# EAGLE design Controller (EAGLE 9.5.2)
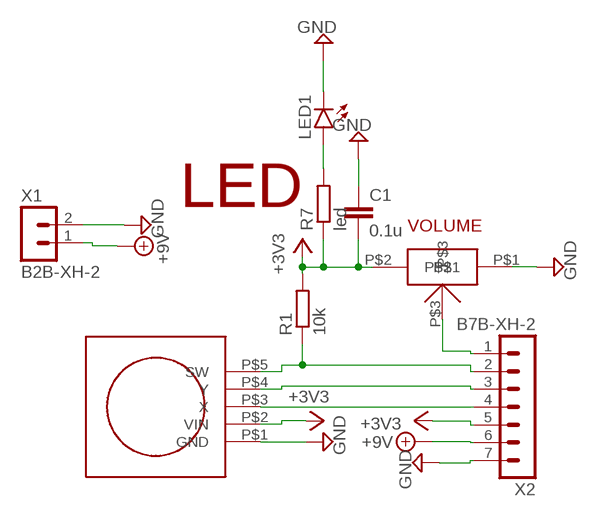
[diagram p0: schematic, sheet 1]

## Parts
C1  0.1u  C-EU050-024X044  [C050-024X044]
JOY1  JOY  [JOY]
LED1  LED3MM  [LED3MM]
POT1  POTENTIOMETER  [POTENTIOMETER]
R1  10k  R-EU_0207/7  [0207/7]
R7  led  R-EU_0207/7  [0207/7]
X1  B2B-XH-2  [B2B-XH-A]
X2  B7B-XH-2  [B7B-XH-A]

## Nets
+3V3: C1.2 JOY1.P$2(VIN) POT1.P$2 R1.2 R7.1 X2.5
+9V: X1.1 X2.6
GND: C1.1 JOY1.P$1(GND) LED1.K(C) POT1.P$1 X1.2 X2.7
N$2: JOY1.P$4(Y) X2.3
N$3: JOY1.P$5(SW) R1.1 X2.2
N$4: POT1.P$3 X2.1
N$5: JOY1.P$3(X) X2.4
N$15: LED1.A R7.2

## Notes on the sheet
- LED
- VOLUME

## Library data of the parts
C1 = rcl:C-EU: CAPACITOR, European symbol; SPICEPREFIX: C
JOY1 = JOYSTICK:JOY
LED1 = led:LED: LED OSRAM: - CHIPLED LG R971, LG N971, LY N971, LG Q971, LY Q971, LO R971, LY R971 LH N974, LH R974 LS Q976, LO Q976, LY Q976 LO Q996 - Hyper CHIPLED LW Q18S LB Q993, LB Q99A, LB R99A - SideLED LS A670, LO A670, LY A670, LG A670, LP A670 LB A673, LV A673, LT A673, LW A673 LH A674 LY A675 LS A676, LA A676, LO A676, LY A676, LW A676 LS A679, LY A679, LG A679 - Hyper Micro SIDELED® LS Y876, LA Y876, LO Y876, LY Y876 LT Y87S - SmartLED LW L88C, LW L88S LB L89C, LB L89S, LG L890 LS L89K, LO L89K, LY L89K LS L896, LA L896, LO L896, LY L896 - TOPLED LS T670, LO T670, LY T670, LG T670, LP T670 LSG T670, LSP T670, LSY T670, LOP T670, LYG T670 LG T671, LOG T671, LSG T671 LB T673, LV T673, LT T673, LW T673 LH T674 LS T676, LA T676, LO T676, LY T676, LB T676, LH T676, LSB T676, LW T676 LB T67C, LV T67C, LT T67C, LS T67K, LO T67K, LY T67K, LW E67C LS E67B, LA E67B, LO E67B, LY E67B, LB E67C, LV E67C, LT E67C LW T67C LS T679, LY T679, LG T679 LS T770, LO T770, LY T770, LG T770, LP T770 LB T773, LV T773, LT T773, LW T773 LH T774 LS E675, LA E675, LY E675, LS T675 LS T776, LA T776, LO T776, LY T776, LB T776 LHGB T686 LT T68C, LB T68C - Hyper Mini TOPLED® LB M676 - Mini TOPLED Santana® LG M470 LS M47K, LO M47K, LY M47K Source: http://www.osram.convergy.de LUXEON: - LUMILED® LXK2-PW12-R00, LXK2-PW12-S00, LXK2-PW14-U00, LXK2-PW14-V00 LXK2-PM12-R00, LXK2-PM12-S00, LXK2-PM14-U00 LXK2-PE12-Q00, LXK2-PE12-R00, LXK2-PE12-S00, LXK2-PE14-T00, LXK2-PE14-U00 LXK2-PB12-K00, LXK2-PB12-L00, LXK2-PB12-M00, LXK2-PB14-N00, LXK2-PB14-P00, LXK2-PB14-Q00 LXK2-PR12-L00, LXK2-PR12-M00, LXK2-PR14-Q00, LXK2-PR14-R00 LXK2-PD12-Q00, LXK2-PD12-R00, LXK2-PD12-S00 LXK2-PH12-R00, LXK2-PH12-S00 LXK2-PL12-P00, LXK2-PL12-Q00, LXK2-PL12-R00 Source: www.luxeon.com KINGBRIGHT: KA-3528ASYC Source: www.kingbright.com
POT1 = potentiometer:POTENTIOMETER
R1 R7 = rcl:R-EU_: RESISTOR, European symbol; SPICEPREFIX: R
X1 = con-JST XH:B2B-XH: JST XH series header 2.50mm pitch disconnectable crimp style connectors, vertical (side entry type), 2 pins
X2 = con-JST XH:B7B-XH: JST XH series header 2.50mm pitch disconnectable crimp style connectors, vertical (side entry type), 7 pins

## Net classes
0 default: clearance 0.508 mm

## Board
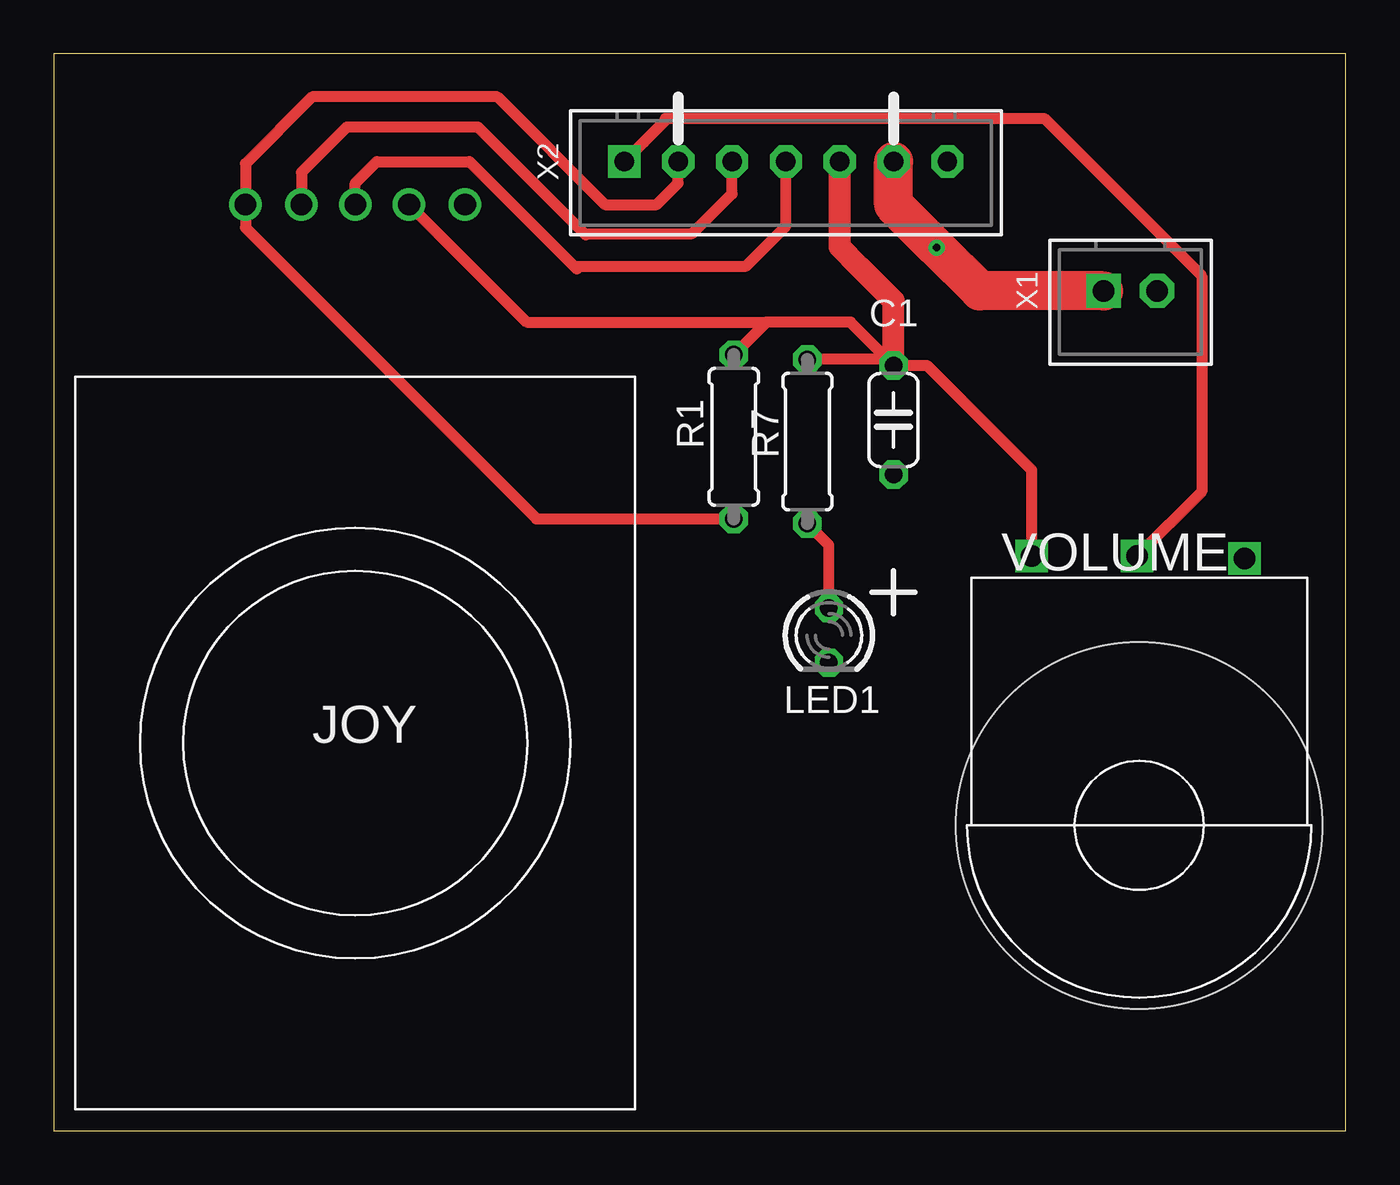
[diagram p1: board, top side]
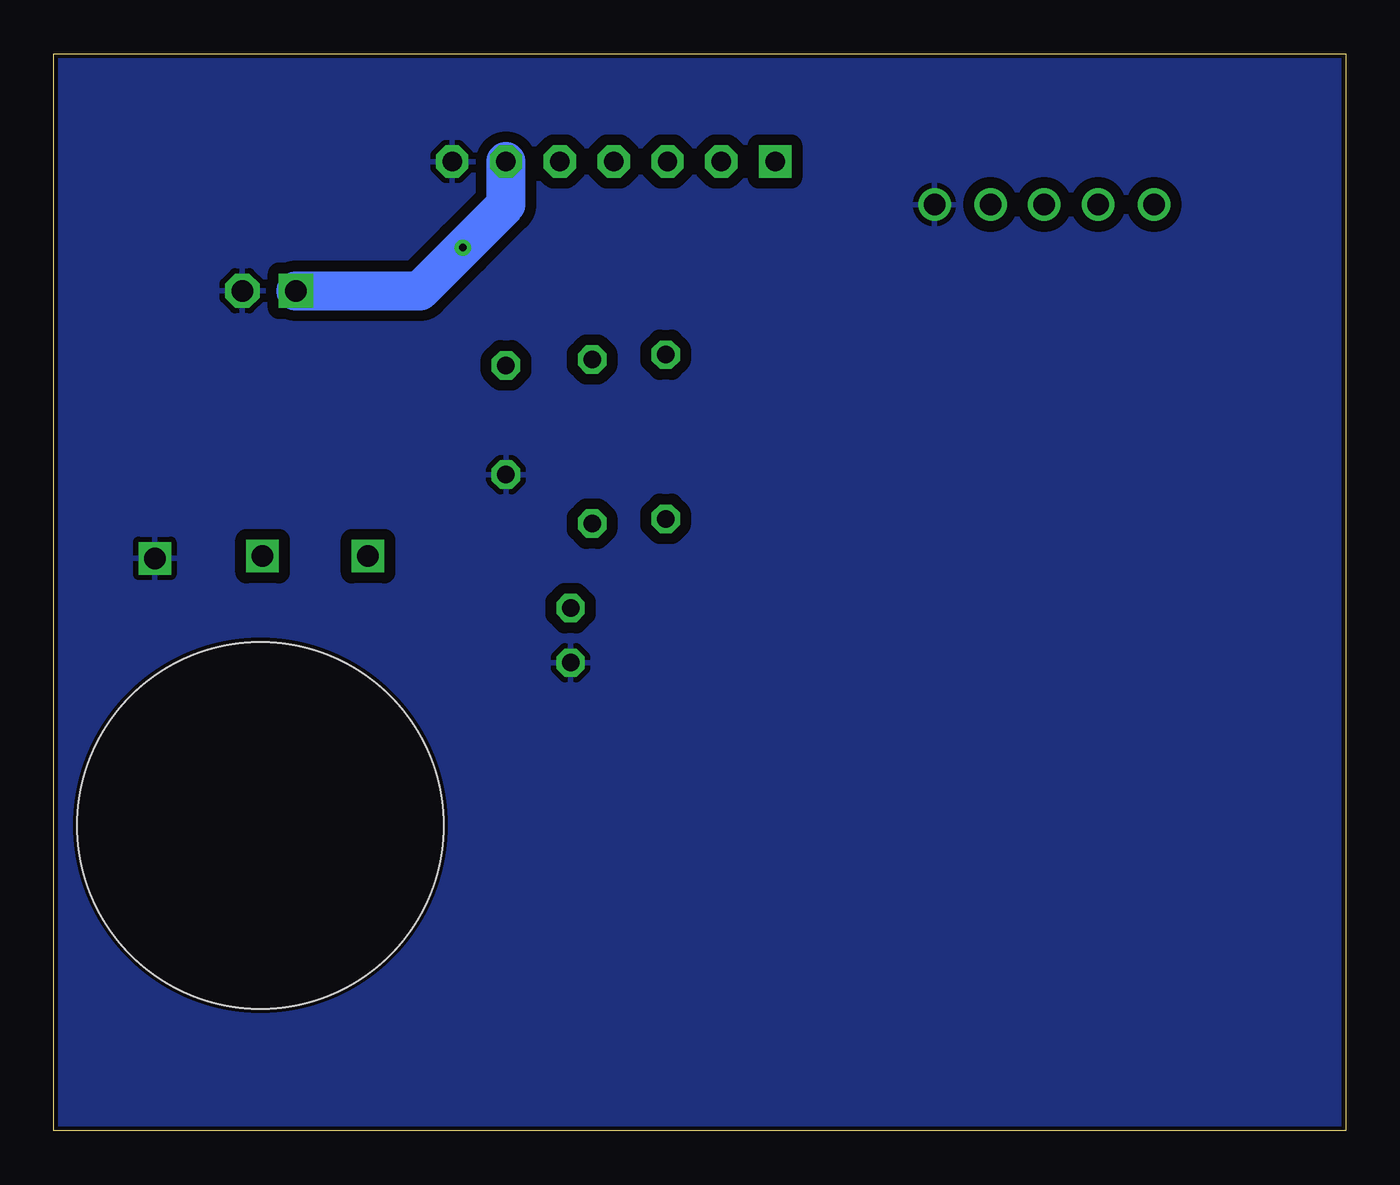
[diagram p2: board, bottom side, seen from below]

Size 60 x 50 mm. Coordinates in mm from the lower left corner, seen from the top.
Outline: 0,0 60,0 60,50 0,50 0,0
Copper layers (1*16): Top 0.035mm / dielectric 1.5mm / Bottom 0.035mm
Design rules "PCBGoGo": minimum track width 6mil, minimum drill 0.2mm, track to track 6mil, track to pad 6mil, pad to pad 6mil, via to via 6mil, smd to smd 6mil, copper to edge 0.2mm, drill to drill 6mil, minimum pad ring 10mil, minimum via ring 8mil, stop-mask expansion 4mil, vias tented up to drill 0mil, thermal gap 10mil
Holes 17 mm at 50.41,14.18

### Footprints (pad centres in the part's own frame; a part is rotated, then mirrored left to right if it is on the bottom)
C050-024X044 = drill 0.813 octagon: 1 -2.54,0; 2 2.54,0
JOY = drill 1: P$1 5.1,25; P$2 2.5,25; P$3 0,25; P$4 -2.5,25; P$5 -5.1,25
LED3MM = drill 0.813 octagon: A -1.27,0; K 1.27,0
POTENTIOMETER = drill 1 square: P$1 4.9,12.4; P$2 -5,12.5; P$3 -0.1,12.5
0207/7 = drill 0.813 octagon: 1 -3.81,0; 2 3.81,0
B2B-XH-A = drill 1 pad 1.6 square: 1 1.25,0 | drill 1 pad 1.6 octagon: 2 -1.25,0
B7B-XH-A = drill 0.9 pad 1.5 square: 1 7.5,0 | drill 0.9 pad 1.5 octagon: 2 5,0; 3 2.5,0; 4 0,0; 5 -2.5,0; 6 -5,0; 7 -7.5,0

### Placement (x,y rotation side)
C1  39,33 90 top
JOY1  14,18 0 top
LED1  36,23 270 top
POT1  50.41,14.18 0 top
R1  31.58,32.22 90 top
R7  35,32 270 top
X1  50,39 180 top
X2  34,45 180 top

### Tracks (layer width: path | path; a pad name or v marks a point on that pad's centre or on a via)
+3V3
  Top 0.508: C1.2 40.55,35.54 45.41,30.68 POT1.P$2 | C1.2 38.73,35.81 R7.1 | 33.09,37.54 R1.2 | C1.2 37,37.54 33.09,37.54 | JOY1.P$2 21.96,37.54 33.09,37.54
  Top 1.016: C1.2 39,38.54 37.39,40.15 36.5,41.04 X2.5
+9V  (via drill 0.35)
  Top 1.8: X1.1 43,39 v41,41 39,43 X2.6
  Bottom 1.8: X1.1 43,39 v41,41 39,43 X2.6
GND
  pour Bottom: 0,50 0,0 60,0 60,50
N$2
  Top 0.508: JOY1.P$4 11.5,44.5 13.6,46.6 19.7,46.6 24.65,41.65 | 24.7,41.6 24.65,41.65 | 24.65,41.65 29.65,41.65 31.5,43.5 X2.3
N$3
  Top 0.508: R1.1 22.42,28.41 8.9,41.93 JOY1.P$5 8.9,44.9 12,48 20.6,48 25.6,43 28,43 29,44 X2.2
N$4
  Top 0.508: POT1.P$3 53.31,29.68 53.31,39.69 46,47 28.39,47 28.39,46.9 27.39,45.9 27.39,45.89 X2.1
N$5
  Top 0.508: JOY1.P$3 14,44 15,45 19.3,45 24.15,40.15 | 24.15,40.15 24.3,40 | 24.15,40.15 32.15,40.15 34,42 X2.4
N$15
  Top 0.508: LED1.A 36,27.19 R7.2

### Text on the board
tPlace: VOLUME | JOY